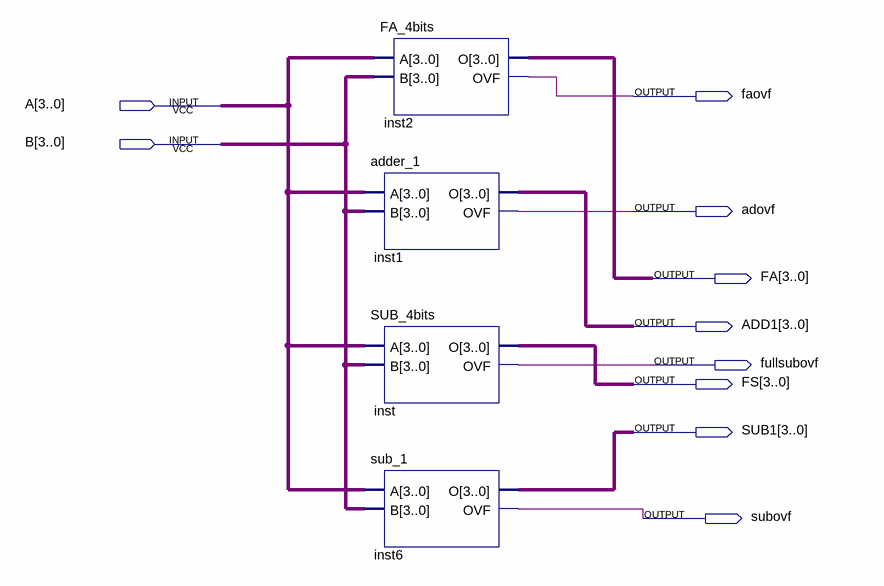
[diagram p0: schematic sheet]
// Quartus schematic Arithmetic.bdf as structural Verilog: 4 symbols, 10 pins
module Arithmetic (
  input  [3:0] A,
  input  [3:0] B,
  output faovf,
  output adovf,
  output [3:0] FA,
  output [3:0] ADD1,
  output fullsubovf,
  output [3:0] FS,
  output [3:0] SUB1,
  output subovf
);

  FA_4bits inst2 (.A(A), .B(B), .O(FA), .OVF(faovf));
  adder_1 inst1 (.A(A), .B(B), .O(ADD1), .OVF(adovf));
  SUB_4bits inst (.A(A), .B(B), .O(FS), .OVF(fullsubovf));
  sub_1 inst6 (.A(A), .B(B), .O(SUB1), .OVF(subovf));
endmodule
